# Altium schematic sheet 智能小车.SchDoc
size A3
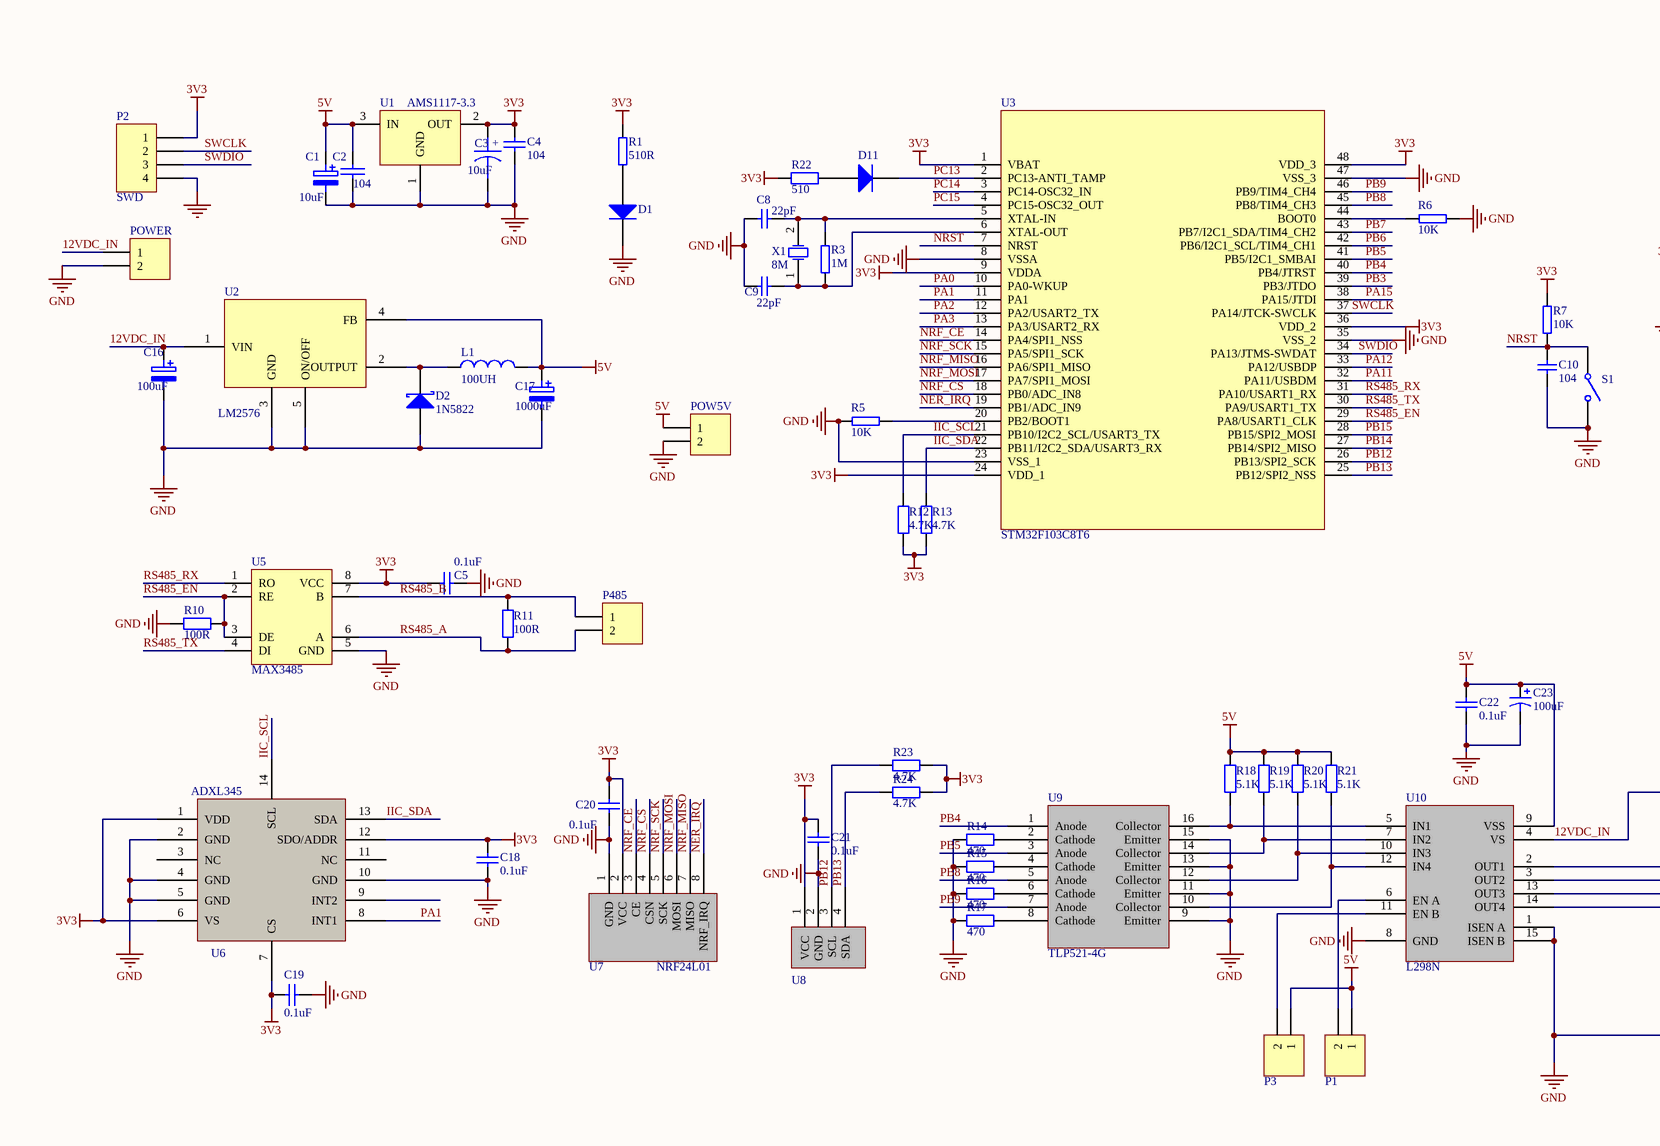
[diagram p0: 智能小车.SchDoc, left]
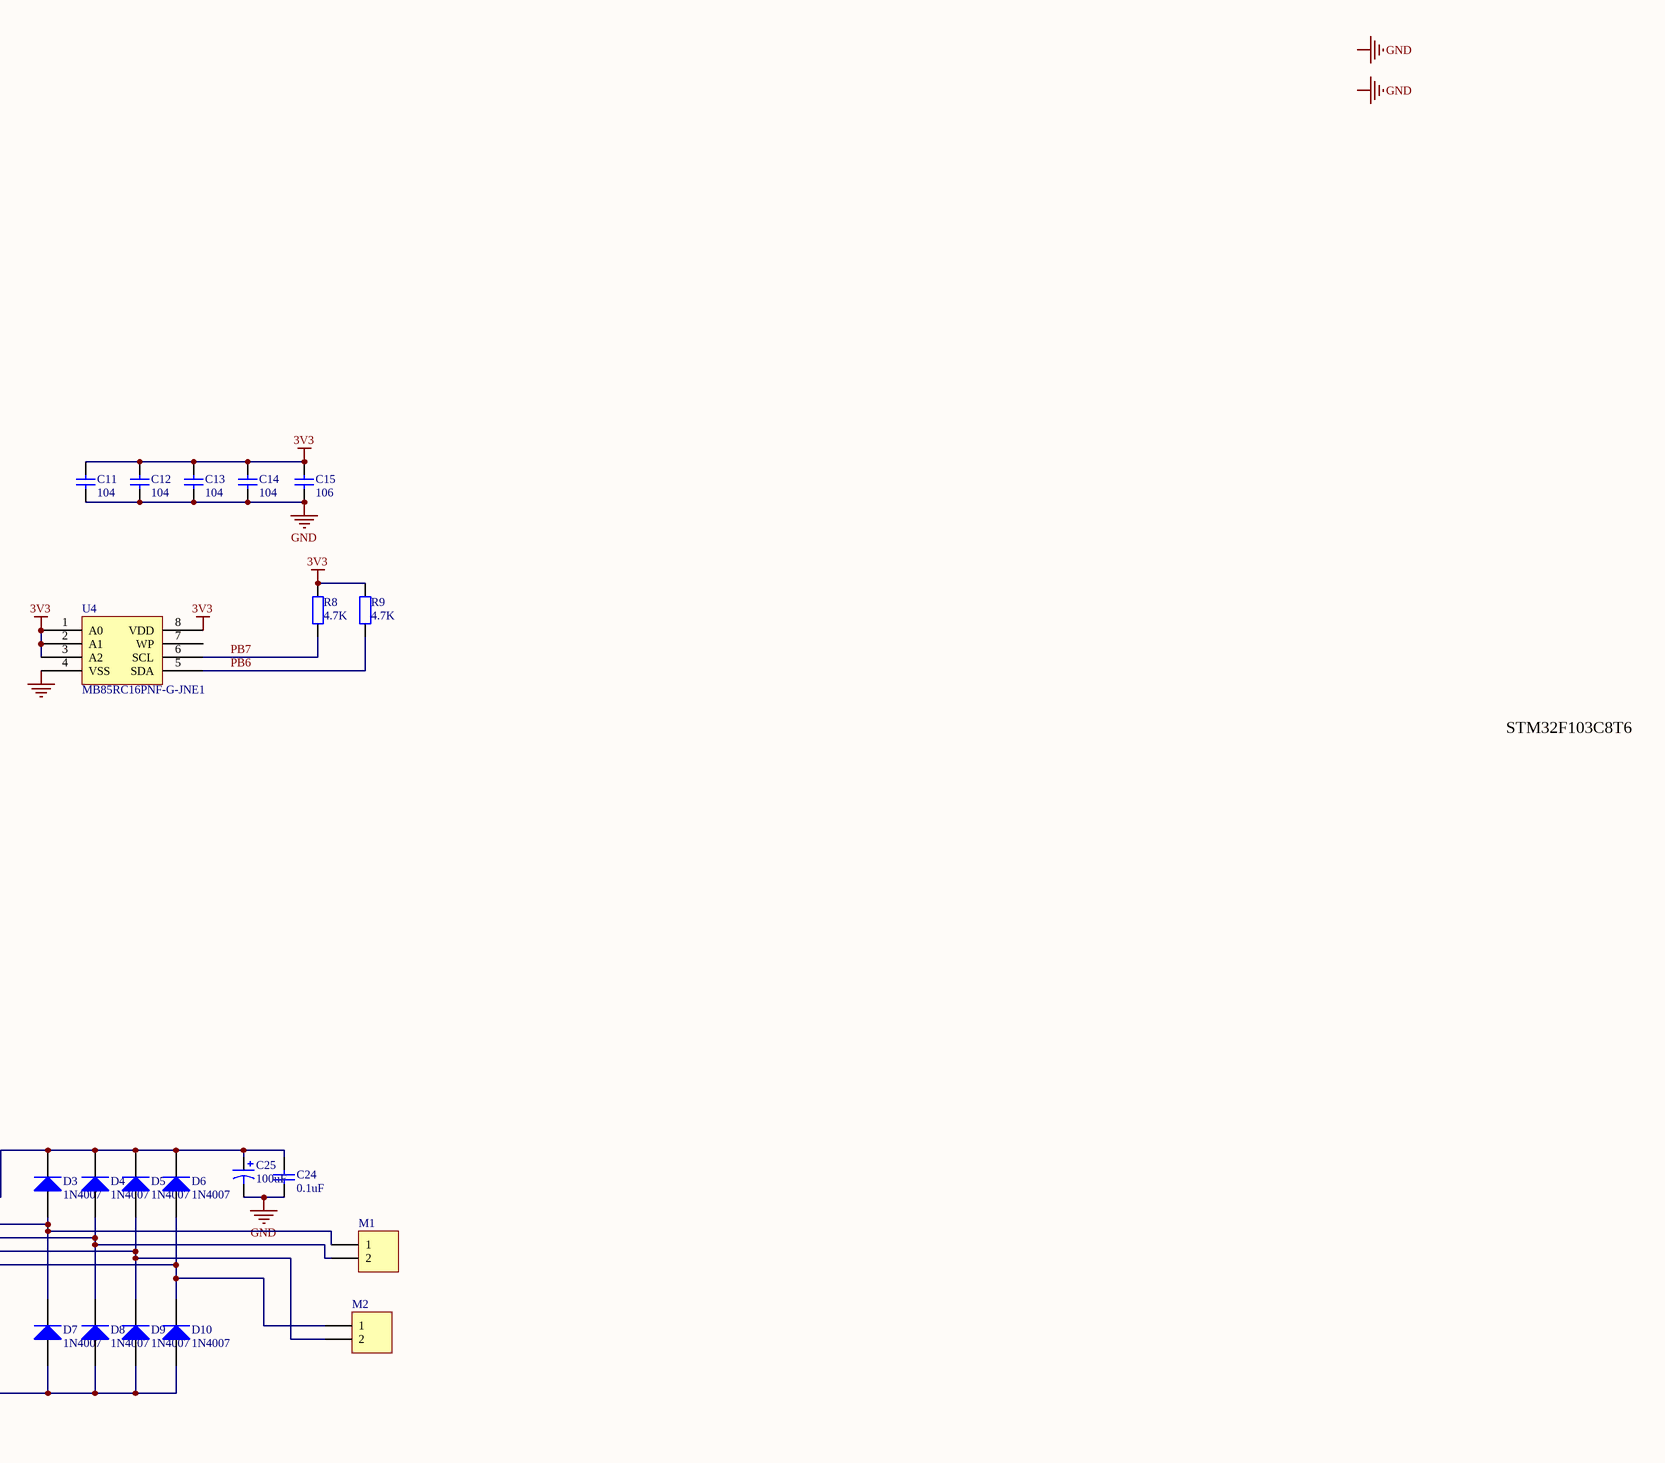
[diagram p1: 智能小车.SchDoc, right]

## Parts
C1  10uF  [3216]
C2  104  [0805]
C3  10uF  [3216]
C4  104  [0805]
C5  value 0.1uF  [0805]  (hidden comment: 无源贴片电容)
C8  22pF  [0805]
C9  22pF  [0805]
C10  104  [0805]
C11  104  [0805]
C12  104  [0805]
C13  104  [0805]
C14  104  [0805]
C15  106  [0805]
C16  100uF  [DIP2SMD]
C17  1000uF  [DIP2SMD]
C18  value 0.1uF  [0805]  (hidden comment: 无源贴片电容)
C19  value 0.1uF  [0805]  (hidden comment: 无源贴片电容)
C20  value 0.1uF  [0805]  (hidden comment: 无源贴片电容)
C21  value 0.1uF  [0805]  (hidden comment: 无源贴片电容)
C22  value 0.1uF  [0805]  (hidden comment: 无源贴片电容)
C23  value 100uF  [DIP2SMD]  (hidden comment: Cap Pol1)
C24  value 0.1uF  [0805]  (hidden comment: 无源贴片电容)
C25  value 100uF  [DIP2SMD]  (hidden comment: Cap Pol1)
D1  Diode  [LED]  (value not drawn)
D2  1N5822  [DO-204AL]
D3  1N4007  [DO-41]
D4  1N4007  [DO-41]
D5  1N4007  [DO-41]
D6  1N4007  [DO-41]
D7  1N4007  [DO-41]
D8  1N4007  [DO-41]
D9  1N4007  [DO-41]
D10  1N4007  [DO-41]
D11  Diode  [LED]  (value not drawn)
L1  value 100UH  [L]  (hidden comment: Inductor)
M1  Header 2  [端子]  (value not drawn)
M2  Header 2  [端子]  (value not drawn)
P1  Header 2  [HDR1X2]  (value not drawn)
P2  SWD  [HDR1X4]
P3  Header 2  [HDR1X2]  (value not drawn)
P485  Header 2  [端子]  (value not drawn)
POW5V  Header 2  [端子]  (value not drawn)
POWER  Header 2  [端子]  (value not drawn)
R1  510R  [0805]
R3  1M  [0805]
R5  10K  [0805]
R6  10K  [0805]
R7  10K  [0805]
R8  4.7K  [0805]
R9  4.7K  [0805]
R10  100R  [0805]
R11  value 100R  [0805]  (hidden comment: 贴片电阻 1%)
R12  4.7K  [0805]
R13  4.7K  [0805]
R14  value 470  [0805]  (hidden comment: 4.7K)
R15  value 470  [0805]  (hidden comment: 4.7K)
R16  value 470  [0805]  (hidden comment: 4.7K)
R17  value 470  [0805]  (hidden comment: 4.7K)
R18  value 5.1K  [0805]  (hidden comment: 4.7K)
R19  value 5.1K  [0805]  (hidden comment: 4.7K)
R20  value 5.1K  [0805]  (hidden comment: 4.7K)
R21  value 5.1K  [0805]  (hidden comment: 4.7K)
R22  value 510  [0805]  (hidden comment: Res2)
R23  4.7K  [0805]
R24  4.7K  [0805]
S1  SW-SPST  [SWITCH]  (value not drawn)
U1  AMS1117-3.3  [SOT223]
U2  LM2576  [LM2576]
U3  STM32F103C8T6  [STM32F103C8T6]
U4  MB85RC16PNF-G-JNE1  [SO-8]
U5  MAX3485  [SO-8]
U6  ADXL345  [LGA14-ADXL345]
U7  NRF24L01  [NRF24L01]
U8  OLED  [IDCD4]  (value not drawn)
U9  TLP521-4G  [SOP-16]
U10  L298N  [L298N]
X1  8M  [晶振]

## Nets
3V3: C3.1 C4.1 C5.1 C11.1 C12.1 C13.1 C14.1 C15.1 C18.1 C19.2 C20.1 C21.2 P2.1 R1.2 R7.2 R8.2 R9.2 R12.1 R13.2 R22.1 R23.1 R24.1 U1.2(OUT) U3.1(VBAT) U3.9(VDDA) U3.24(VDD_1) U3.36(VDD_2) U3.48(VDD_3) U4.1(A0) U4.2(A1) U4.3(A2) U4.8(VDD) U5.8(VCC) U6.1(VDD) U6.6(VS) U6.7(CS) U6.12(SDO/ADDR) U7.2(VCC) U8.1(VCC)
5V: C1.1 C2.1 C17.1 C22.2 C23.1 L1.2 P1.1 P3.1 POW5V.1 R18.2 R19.2 R20.2 R21.2 U1.3(IN) U2.4(FB) U10.9(VSS)
GND: C1.2 C2.2 C3.2 C4.2 C5.2 C8.2 C9.2 C10.2 C11.2 C12.2 C13.2 C14.2 C15.2 C16.2 C17.2 C18.2 C19.1 C20.2 C21.1 C22.1 C23.2 C24.1 C25.2 D1.2(K) D2.1(A) D7.1(A) D8.1(A) D9.1(A) D10.1(A) P2.4 POW5V.2 POWER.2 R5.2 R6.1 R10.1 R14.1 R15.1 R16.1 R17.1 S1.2(NO) U1.1(GND) U2.3(GND) U2.5(ON/OFF) U3.8(VSSA) U3.23(VSS_1) U3.35(VSS_2) U3.47(VSS_3) U4.4(VSS) U5.5(GND) U6.2(GND) U6.4(GND) U6.5(GND) U6.10(GND) U7.1(GND) U8.2(GND) U9.9(Emitter) U9.11(Emitter) U9.13(Emitter) U9.15(Emitter) U10.1(ISEN_A) U10.8(GND) U10.15(ISEN_B)
12VDC_IN: C16.1 C24.2 C25.1 D3.2(K) D4.2(K) D5.2(K) D6.2(K) POWER.1 U2.1(VIN) U10.4(VS)
IIC_SCL: R12.2 U3.21(PB10/I2C2_SCL/USART3_TX) U6.14(SCL)
IIC_SDA: R13.1 U3.22(PB11/I2C2_SDA/USART3_RX) U6.13(SDA)
NER_IRQ: U3.19(PB1/ADC_IN9) U7.8(NRF_IRQ)
NRF_CE: U3.14(PA4/SPI1_NSS) U7.3(CE)
NRF_CS: U3.18(PB0/ADC_IN8) U7.4(CSN)
NRF_MISO: U3.16(PA6/SPI1_MISO) U7.7(MISO)
NRF_MOSI: U3.17(PA7/SPI1_MOSI) U7.6(MOSI)
NRF_SCK: U3.15(PA5/SPI1_SCK) U7.5(SCK)
NRST: C10.1 R7.1 S1.1(COMMON) U3.7(NRST)
PA0: U3.10(PA0-WKUP)
PA1: U3.11(PA1) U6.8(INT1)
PA2: U3.12(PA2/USART2_TX)
PA3: U3.13(PA3/USART2_RX)
PA11: U3.32(PA11/USBDM)
PA12: U3.33(PA12/USBDP)
PA15: U3.38(PA15/JTDI)
PB3: U3.39(PB3/JTDO)
PB4: U3.40(PB4/JTRST) U9.1(Anode)
PB5: U3.41(PB5/I2C1_SMBAI) U9.3(Anode)
PB6: R9.1 U3.42(PB6/I2C1_SCL/TIM4_CH1) U4.5(SDA)
PB7: R8.1 U3.43(PB7/I2C1_SDA/TIM4_CH2) U4.6(SCL)
PB8: U3.45(PB8/TIM4_CH3) U9.5(Anode)
PB9: U3.46(PB9/TIM4_CH4) U9.7(Anode)
PB12: R23.2 U3.26(PB13/SPI2_SCK) U8.3(SCL)
PB13: R24.2 U3.25(PB12/SPI2_NSS) U8.4(SDA)
PB14: U3.27(PB14/SPI2_MISO)
PB15: U3.28(PB15/SPI2_MOSI)
PC13: D11.2(K) U3.2(PC13-ANTI_TAMP)
PC14: U3.3(PC14-OSC32_IN)
PC15: U3.4(PC15-OSC32_OUT)
RS485_A: P485.2 R11.1 U5.6(A)
RS485_B: P485.1 R11.2 U5.7(B)
RS485_EN: R10.2 U3.29(PA8/USART1_CLK) U5.2(RE) U5.3(DE)
RS485_RX: U3.31(PA10/USART1_RX) U5.1(RO)
RS485_TX: U3.30(PA9/USART1_TX) U5.4(DI)
SWCLK: P2.2 U3.37(PA14/JTCK-SWCLK)
SWDIO: P2.3 U3.34(PA13/JTMS-SWDAT)
NetC8_1: C8.1 R3.2 U3.5(XTAL-IN) X1.2
NetC9_1: C9.1 R3.1 U3.6(XTAL-OUT) X1.1
NetD1_1: D1.1(A) R1.1
NetD2_2: D2.2(K) L1.1 U2.2(OUTPUT)
NetD3_1: D3.1(A) D7.2(K) M1.1 U10.2(OUT1)
NetD4_1: D4.1(A) D8.2(K) M1.2 U10.3(OUT2)
NetD5_1: D5.1(A) D9.2(K) M2.2 U10.13(OUT3)
NetD6_1: D6.1(A) D10.2(K) M2.1 U10.14(OUT4)
NetD11_1: D11.1(A) R22.2
NetP1_2: P1.2 U10.6(EN_A)
NetP3_2: P3.2 U10.11(EN_B)
NetR5_1: R5.1 U3.20(PB2/BOOT1)
NetR6_2: R6.2 U3.44(BOOT0)
NetR14_2: R14.2 U9.2(Cathode)
NetR15_2: R15.2 U9.4(Cathode)
NetR16_2: R16.2 U9.6(Cathode)
NetR17_2: R17.2 U9.8(Cathode)
NetR18_1: R18.1 U9.16(Collector) U10.5(IN1)
NetR19_1: R19.1 U9.14(Collector) U10.7(IN2)
NetR20_1: R20.1 U9.12(Collector) U10.10(IN3)
NetR21_1: R21.1 U9.10(Collector) U10.12(IN4)

Not connected (* = marked no-connect by the designer): U4 7(WP); U6 3(NC) 9(INT2) 11(NC)

## Notes on the sheet
- STM32F103C8T6
- Labels drawn without touching a wire or pin: GND
- (in symbol CAPACITOR POL) +

## Library data of the parts
C1 C16 C17 = ELECTRO2
C2 = CAP: Capacitor
C3 = CAPACITOR POL: Capacitor
C4 C5 C18-C22 C24 = Cap: Capacitor; Published: 8-Jun-2000; LatestRevisionDate: 17-Jul-2002; LatestRevisionNote: Re-released for DXP Platform.; PackageReference: RAD-0.3; Publisher: Altium Limited
  C5 C18-C22 C24: PackageDescription: Radial Cap, Thru-Hole; 2 Leads; 0.3 in Pin Spacing
C8 C9 = CAP1: Capacitor; Tolerate: 50V; Value: 20pF; TOL: 2%; ERP: 0103020090; PCB_Layout: Top Layer SMC; Revision: 2012-3-28; Publisher: ZL_A0OFFICE
C10-C15 = CAP1: Capacitor; Tolerate: 50V; Value: 100nF; TOL: 10%; ERP: 0103020075; PCB_Layout: Top Layer SMC; Revision: 2012-3-28; Publisher: ZL_A0OFFICE
C23 C25 = Cap Pol1: Polarized Capacitor (Radial); Published: 8-Jun-2000; LatestRevisionDate: 17-Jul-2002; LatestRevisionNote: Re-released for DXP Platform.; PackageReference: RB7.6-15; Publisher: Altium Limited
D1 D11 = Diode: Default Diode; Published: 8-Jun-2000; LatestRevisionDate: 17-Jul-2002; LatestRevisionNote: Re-released for DXP Platform.; PackageDocument: Sep-1996; PackageReference: SMC; Publisher: Altium Limited; Code_JEDEC: DO-214-AB
D2 = Diode 11DQ03: Schottky Rectifier; Published: 8-Jun-2000; LatestRevisionDate: 17-Jul-2002; LatestRevisionNote: Re-released for DXP Platform.; DatasheetDocument: Dec-1997; PackageReference: DO-204AL; Publisher: Altium Limited; Code_JEDEC: DO-204-AL; ComponentLink1Description: Manufacturer Link; ComponentLink1URL: http://www.irf.com/; ComponentLink2Description: Datasheet; ComponentLink2URL: http://www.irf.com/product-info/datasheets/data/11dq03.pdf
D3-D10 = Diode 1N4007: 1 Amp General Purpose Rectifier; Published: 8-Jun-2000; LatestRevisionDate: 17-Jul-2002; LatestRevisionNote: Re-released for DXP Platform.; DatasheetDocument: 1998; PackageDocument: Aug-1999; PackageReference: DO-41; Publisher: Altium Limited; Code_JEDEC: DO-204-AL; ComponentLink1Description: Manufacturer Link; ComponentLink1URL: http://www.fairchildsemi.com/; ComponentLink2Description: Datasheet; ComponentLink2URL: http://www.fairchildsemi.com/ds/1N%2F1N4001.pdf
L1 = Inductor: Code_IEC: 1005; Published: 8-Jun-2000; LatestRevisionDate: 17-Jul-2002; LatestRevisionNote: Re-released for DXP Platform.; PackageReference: 0402-A; Publisher: Altium Limited; Code_JEITA: 0402
M1 M2 P1 P3 P485 POW5V POWER = Header 2: Header, 2-Pin; LatestRevisionDate: 17-Jul-2002; LatestRevisionNote: Re-released for DXP Platform.; Publisher: Altium Limited
P2 = Header 4H: Header, 4-Pin, Right Angle; LatestRevisionDate: 17-Jul-2002; LatestRevisionNote: Re-released for DXP Platform.; Publisher: Altium Limited
R1 R3 R5-R7 = R
R8 R9 R12-R21 R23 R24 = Res2: 贴片电阻 精度1%; Published: 8-Jun-2000; LatestRevisionDate: 17-Jul-2002; LatestRevisionNote: Re-released for DXP Platform.; PackageReference: AXIAL-0.4; Publisher: Altium Limited; PackageDescription: Axial Device, Thru-Hole; 2 Leads; 0.4 in Pin Spacing
  R8 R9 R12 R13 R23 R24: Value: 4.7K
R10 R11 R22 = Res2: Resistor; Published: 8-Jun-2000; LatestRevisionDate: 17-Jul-2002; LatestRevisionNote: Re-released for DXP Platform.; PackageReference: AXIAL-0.4; Publisher: Altium Limited
  R10: Value: 100R
  R11: PackageDescription: Axial Device, Thru-Hole; 2 Leads; 0.4 in Pin Spacing
S1 = SW-SPST: Single-Pole, Single-Throw Switch
U1 = LT1085CM-3.3
U4 = MB85RC16PNF-G-JNE1: EEPROM存储
U5 = SP3485: 485总线芯片
X1 = XTAL_SMD: Crystal Oscillator; ERP: 0103040021; Value: 8MHz; TOL: ±20ppm; Tolerate: ROSON -20_+70 20pf; PCB_Layout: Top Layer SMC; Publisher: ZL_A0OFFICE; Revision: 2012-3-28